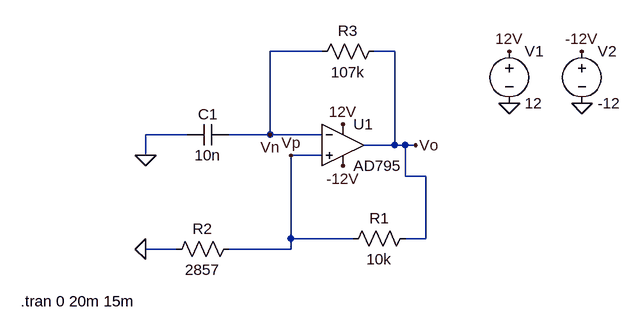
[diagram p0: schematic lab9.3.1.asc]
lab9.3.1.asc, the LTspice schematic file:
Version 4
SHEET 1 880 680
WIRE 128 16 48 16
WIRE 240 16 208 16
WIRE -80 144 -144 144
WIRE 48 144 48 16
WIRE 48 144 -16 144
WIRE 128 144 48 144
WIRE 240 160 240 16
WIRE 240 160 192 160
WIRE 256 160 240 160
WIRE 272 160 256 160
WIRE -144 176 -144 144
WIRE 128 176 80 176
WIRE 256 208 256 160
WIRE 288 208 256 208
WIRE 80 304 80 176
WIRE 176 304 80 304
WIRE 288 304 288 208
WIRE 288 304 256 304
WIRE -96 320 -144 320
WIRE 80 320 80 304
WIRE 80 320 -16 320
FLAG 416 96 0
FLAG 528 96 0
FLAG 416 16 12V
FLAG 160 128 12V
FLAG 528 16 -12V
FLAG 160 192 -12V
FLAG -144 176 0
FLAG 272 160 Vo
FLAG 48 144 Vn
FLAG -144 320 0
FLAG 80 176 Vp
SYMBOL Opamps\\AD795 160 96 R0
SYMATTR InstName U1
SYMBOL voltage 416 0 R0
SYMATTR InstName V1
SYMATTR Value 12
SYMBOL voltage 528 0 R0
SYMATTR InstName V2
SYMATTR Value -12
SYMBOL res 272 288 R90
WINDOW 0 0 56 VBottom 2
WINDOW 3 32 56 VTop 2
SYMATTR InstName R1
SYMATTR Value 10k
SYMBOL res 224 0 R90
WINDOW 0 0 56 VBottom 2
WINDOW 3 32 56 VTop 2
SYMATTR InstName R3
SYMATTR Value 107k
SYMBOL res 0 304 R90
WINDOW 0 0 56 VBottom 2
WINDOW 3 32 56 VTop 2
SYMATTR InstName R2
SYMATTR Value 2857
SYMBOL cap -16 128 R90
WINDOW 0 0 32 VBottom 2
WINDOW 3 32 32 VTop 2
SYMATTR InstName C1
SYMATTR Value 10n
TEXT -336 400 Left 2 !.tran 0 20m 15m

The netlist it stands for:
* lab9.3.1.asc
XU1 Vp Vn 12V -12V Vo AD795  ; pins In+ In- V+ V- OUT
V1 12V 0 12
V2 -12V 0 -12
R1 Vo Vp 10k
R3 Vo Vn 107k
R2 Vp 0 2857
C1 Vn 0 10n
.tran 0 20m 15m
.lib ADI1.lib
.backanno
.end